# Altium schematic sheet rev02_2.SchDoc
size 409 x 282 mm
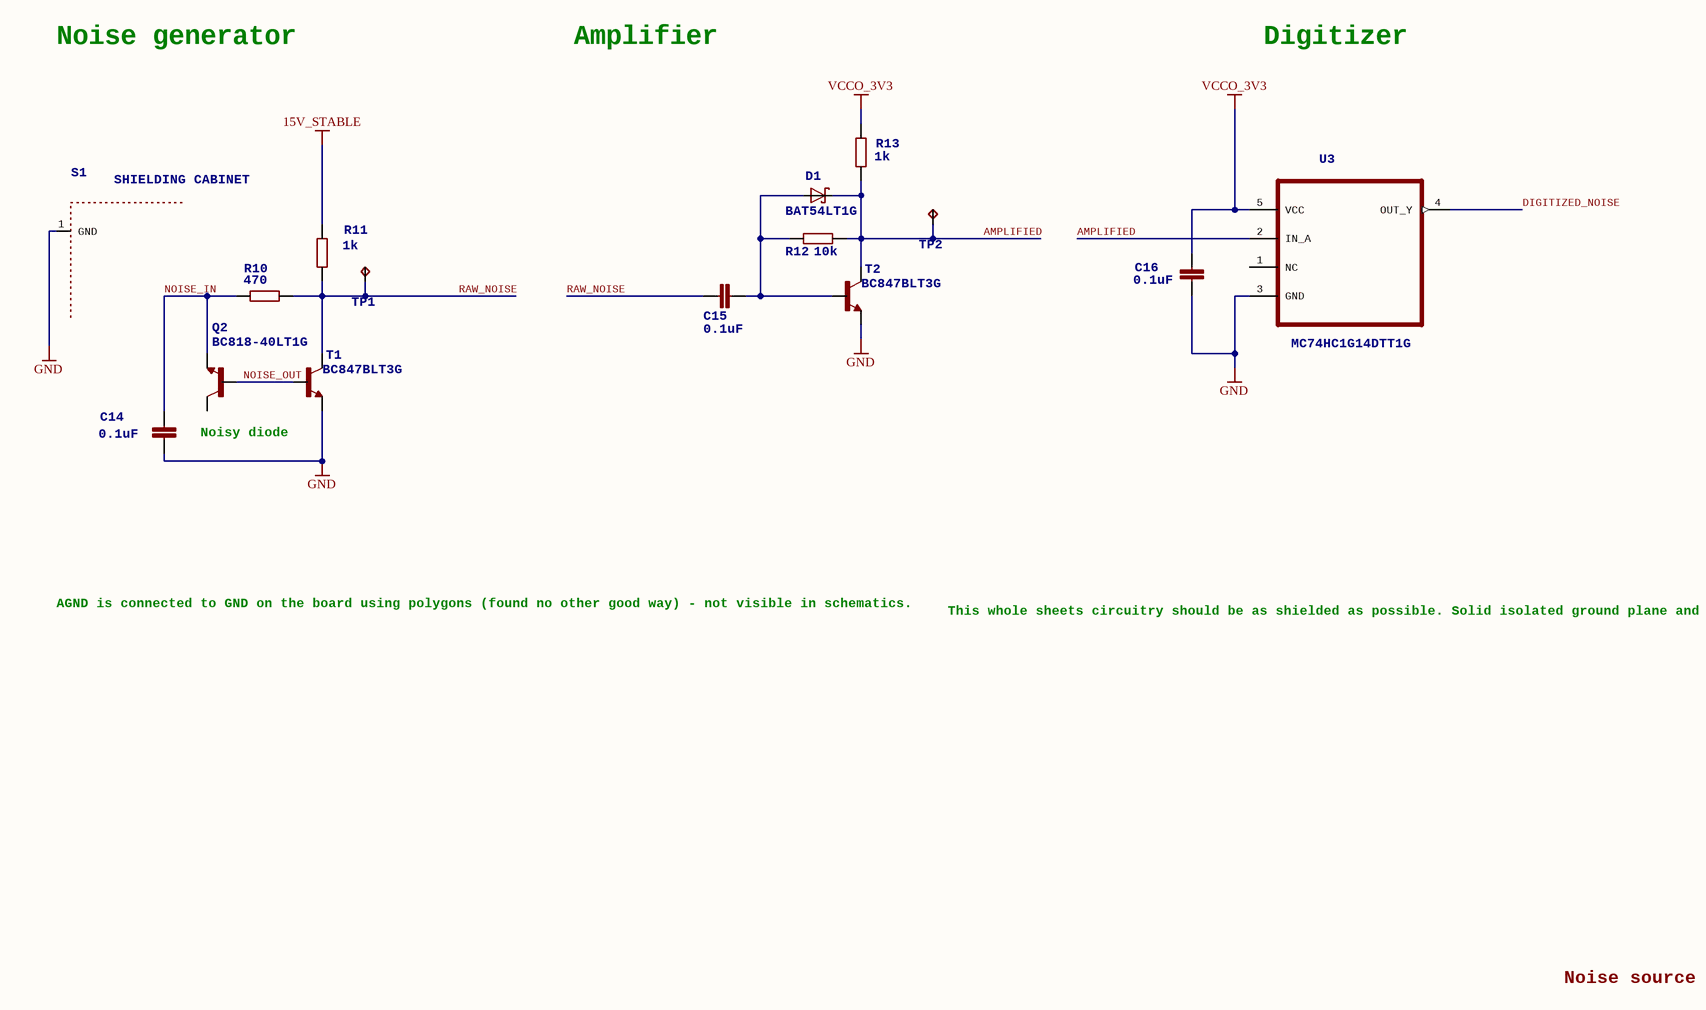
[diagram p0: rev02_2.SchDoc]

## Parts
C14  value 0.1uF  [C_0402]
C15  value 0.1uF  [C_0402]
C16  value 0.1uF  [C_0402]
D1  BAT54LT1G  [SOT-23]
Q2  BC818-40LT1G  [SOT-23]
R10  value 470  [R_0402]
R11  value 1k  [R_0402]
R12  value 10k  [R_0402]
R13  value 1k  [R_0402]
S1  SHIELDING CABINET  [WE-SHC_36103205_NO_CREAM]
T1  BC847BLT3G  [SOT-23]
T2  BC847BLT3G  [SOT-23]
TP1  TPB1,27  [B1,27]  (value not drawn)
TP2  TPB1,27  [B1,27]  (value not drawn)
U3  >NAME: U3  [SOT-23-5]  (hidden comment: MC74HC1G14DTT1G)

## Nets
15V_STABLE: R11.1
GND: C14.1 C16.1 S1.1(GND) T1.2(E) T2.2(E) U3.3(GND)
VCCO_3V3: C16.2 R13.2 U3.5(VCC)
AMPLIFIED: D1.3(C) R12.2 R13.1 T2.3(C) TP2.TP U3.2(IN_A)
DIGITIZED_NOISE: U3.4(OUT_Y)
NOISE_IN: C14.2 Q2.2(E) R10.2
NOISE_OUT: Q2.1(B) T1.1(B)
RAW_NOISE: C15.1 R10.1 R11.2 T1.3(C) TP1.TP
NetC15_2: C15.2 D1.1(A) R12.1 T2.1(B)

Not connected (* = marked no-connect by the designer): Q2 3(C); U3 1(NC)

## Notes on the sheet
- Noise generator
- Amplifier
- Digitizer
- Noisy diode
- AGND is connected to GND on the board using polygons
  (found no other good way) - not visible in schematics.
- This whole sheets circuitry should be as shielded as possible.
  Solid isolated ground plane and internal planes connected
  to the rest of the board at a single point is expected.
- Noise source

## Library data of the parts
C14-C16 = C-EUC0603: 0402 CAPACITOR
D1 = BAT54: OnSemi Schottky Diode
Q2 T1 T2 = BC818*SMD: NPN Transistor
R10-R13 = R-EU_R0402: 0402 Resistor 1%
S1 = WE-SHC: WE-SHC Shielding cabinet
TP1 TP2 = TPB1,27: Test pad
U3 = MC74HC1G14DTT1G: Single Inverter with Schmitt-Trigger Input; MPN: MC74HC1G14DTT1G; OC_FARNELL: 1468757; OC_NEWARK: 71J5593; PACKAGE: SOT-23-5; SUPPLIER: ON SEMICONDUCTOR; >VALUE: MC74HC1G14DTT1G